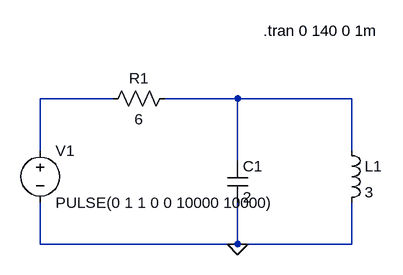
[diagram p0: schematic ej_semana_5.asc]
ej_semana_5.asc, the LTspice schematic file:
Version 4
SHEET 1 880 680
WIRE 160 176 48 176
WIRE 352 176 240 176
WIRE 528 176 352 176
WIRE 48 256 48 176
WIRE 528 256 528 176
WIRE 352 272 352 176
WIRE 48 400 48 336
WIRE 352 400 352 336
WIRE 352 400 48 400
WIRE 528 400 528 336
WIRE 528 400 352 400
FLAG 352 400 0
SYMBOL voltage 48 240 R0
SYMATTR InstName V1
SYMATTR Value PULSE(0 1 1 0 0 10000 10000)
SYMBOL res 256 160 R90
WINDOW 0 0 56 VBottom 2
WINDOW 3 32 56 VTop 2
SYMATTR InstName R1
SYMATTR Value 6
SYMBOL cap 336 272 R0
SYMATTR InstName C1
SYMATTR Value 2
SYMBOL ind 512 240 R0
SYMATTR InstName L1
SYMATTR Value 3
TEXT 392 72 Left 2 !.tran 0 140 0 1m

The netlist it stands for:
* ej_semana_5.asc
V1 N001 0 PULSE(0 1 1 0 0 10000 10000)
R1 N002 N001 6
C1 N002 0 2
L1 N002 0 3
.tran 0 140 0 1m
.backanno
.end